# EAGLE design Webasto v4 (EAGLE 9.5.2)
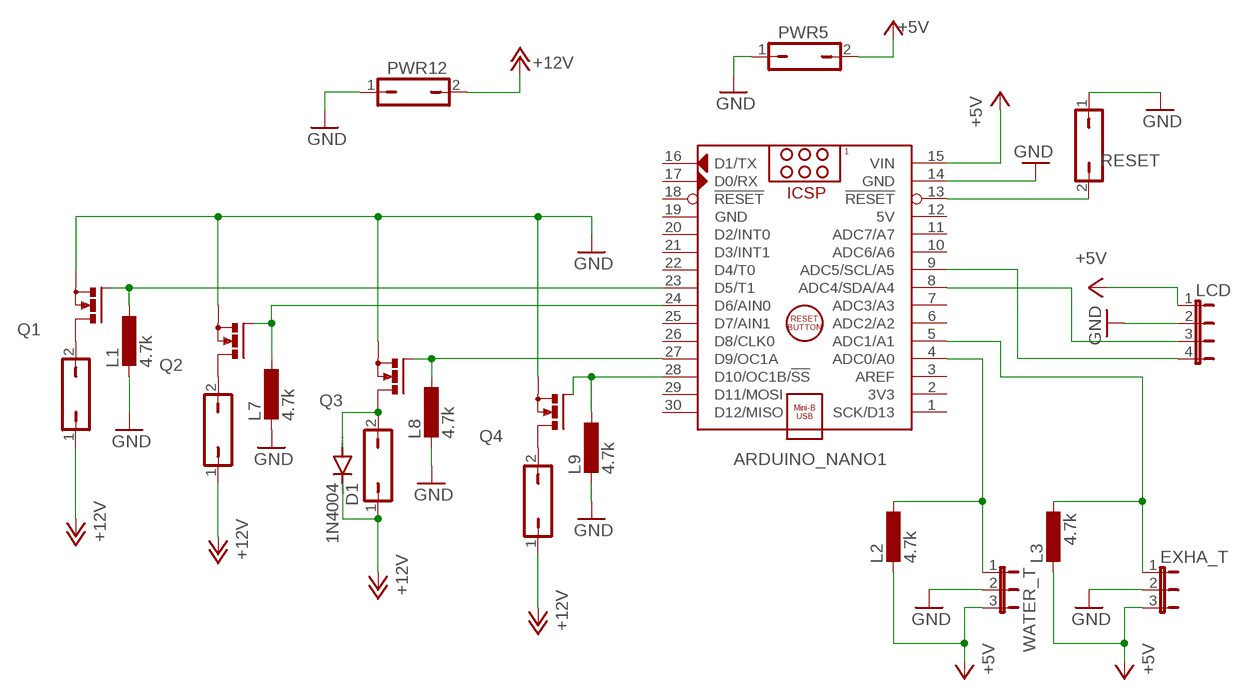
[diagram p0: schematic, sheet 1]

## Parts
ARDUINO_NANO1  ARDUINO_NANO  [ARDUINO_NANO]
D1  1N4004  [DO41-10]
EXHA_T  JP2E  [JP2]
FAN  794681-2  JP1Q  [JP1]
FUEL  794681-2  JP1Q  [JP1]
GLOW  794681-2  JP1Q  [JP1]
L1  4.7k  L-EU0204/7  [0204/7]
L2  4.7k  L-EU0204/7  [0204/7]
L3  4.7k  L-EU0204/7  [0204/7]
L7  4.7k  L-EU0204/7  [0204/7]
L8  4.7k  L-EU0204/7  [0204/7]
L9  4.7k  L-EU0204/7  [0204/7]
LCD  JP4E  [JP4]
PWR5  JP1Q  [JP1]
PWR12  JP1Q  [JP1]
Q1  IRLB8721  PMOSFET_NTO220BV  [TO220BV]
Q2  IRLB8721  PMOSFET_NTO220BV  [TO220BV]
Q3  IRLB8721  PMOSFET_NTO220BV  [TO220BV]
Q4  IRLB8721  PMOSFET_NTO220BV  [TO220BV]
RESET  power  JP1Q  [JP1]
WATER  794681-2  JP1Q  [JP1]
WATER_T  JP2E  [JP2]

## Nets
+5V: ARDUINO_NANO1.15(VIN) EXHA_T.3 L2.2 L3.2 LCD.1 PWR5.2 WATER_T.3
+12V: D1.C FAN.1 FUEL.1 GLOW.1 PWR12.2 WATER.1
GND: ARDUINO_NANO1.14(GND) EXHA_T.2 L1.2 L7.2 L8.2 L9.2 LCD.2 PWR5.1 PWR12.1 Q1.S Q2.S Q3.S Q4.S RESET.1 WATER_T.2
N$1: ARDUINO_NANO1.23(D5/T1) L1.1 Q1.G
N$2: FUEL.2 Q1.D
N$4: ARDUINO_NANO1.24(D6/AIN0) L7.1 Q2.G
N$5: GLOW.2 Q2.D
N$6: ARDUINO_NANO1.27(D9/OC1A) L8.1 Q3.G
N$7: D1.A FAN.2 Q3.D
N$8: ARDUINO_NANO1.28(D10/OC1B/!SS) L9.1 Q4.G
N$9: Q4.D WATER.2
N$10: ARDUINO_NANO1.8(ADC4/SDA/A4) LCD.3
N$11: ARDUINO_NANO1.9(ADC5/SCL/A5) LCD.4
N$12: ARDUINO_NANO1.5(ADC1/A1) EXHA_T.1 L3.1
N$13: ARDUINO_NANO1.4(ADC0/A0) L2.1 WATER_T.1
RESET: ARDUINO_NANO1.13(!RESET) RESET.2
Unconnected: ARDUINO_NANO1.1(SCK/D13) ARDUINO_NANO1.2(3V3) ARDUINO_NANO1.3(AREF) ARDUINO_NANO1.6(ADC2/A2) ARDUINO_NANO1.7(ADC3/A3) ARDUINO_NANO1.10(ADC6/A6) ARDUINO_NANO1.11(ADC7/A7) ARDUINO_NANO1.16(D1/TX) ARDUINO_NANO1.17(D0/RX) ARDUINO_NANO1.18(!RESET) ARDUINO_NANO1.20(D2/INT0) ARDUINO_NANO1.21(D3/INT1) ARDUINO_NANO1.22(D4/T0) ARDUINO_NANO1.25(D7/AIN1) ARDUINO_NANO1.26(D8/CLK0) ARDUINO_NANO1.29(D11/MOSI) ARDUINO_NANO1.30(D12/MISO)

## Power pins joined to a net without a drawn wire
5V: ARDUINO_NANO1.12(5V)
GND: ARDUINO_NANO1.19(GND)

## Library data of the parts
ARDUINO_NANO1 = ArduinoNanoV30:ARDUINO_NANO: Arduino Nano V3.0 Module Overview: The Arduino Nano is a small, complete, and breadboard-friendly board based on the ATmega328 (Arduino Nano 3.x) or ATmega168 (Arduino Nano 2.x). It has more or less the same functionality of the Arduino Duemilanove, but in a different package. It lacks only a DC power jack, and works with a Mini-B USB cable instead of a standard one. The Nano was designed and is being produced by Gravitech <http://www.gravitech.us/arna30wiatp.html>. General specifications: Item Value Microcontroller Atmel ATmega168 or ATmega328 Operating Voltage (logic level) 5 V Input Voltage (recommended) 7-12 V Input Voltage (limits) 6-20 V Digital I/O Pins 14 (of which 6 provide PWM output) Analog Input Pins 8 DC Current per I/O Pin 40 mA Flash Memory 16 KB (ATmega168) or 32 KB (ATmega328) of which 2 KB used by bootloader SRAM 1 KB (ATmega168) or 2 KB (ATmega328) EEPROM 512 bytes (ATmega168) or 1 KB (ATmega328) Clock Speed 16 MHz Dimensions (Inches) 0.73" x 1.70" Dimensions (mm) 18mm x 45mm Overall height About 9 mm (not including pins) Weigth 5 g Power: The Arduino Nano can be powered via the Mini-B USB connection, 6-20V unregulated external power supply (pin 30), or 5V regulated external power supply (pin 27). The power source is automatically selected to the highest voltage source. Memory: The ATmega168 has 16 KB of flash memory for storing code (of which 2 KB is used for the bootloader); the ATmega328 has 32 KB, (also with 2 KB used for the bootloader). The ATmega168 has 1 KB of SRAM and 512 bytes of EEPROM (which can be read and written with the EEPROM library); the ATmega328 has 2 KB of SRAM and 1 KB of EEPROM. Input and Output: Each of the 14 digital pins on the Nano can be used as an input or output, using pinMode(), digitalWrite(), and digitalRead() functions. They operate at 5 volts. Each pin can provide or receive a maximum of 40 mA and has an internal pull-up resistor (disconnected by default) of 20-50 kOhms. In addition, some pins have specialized functions. Visit Arduino - ArduinoBoardNano <https://www.arduino.cc/en/Main/ArduinoBoardNano>
D1 = diode:1N4004: DIODE general purpose rectifier, 1 A
EXHA_T WATER_T = jumper:JP2E: JUMPER
FAN FUEL GLOW PWR5 PWR12 RESET WATER = jumper:JP1Q: JUMPER
L1-L3 L7-L9 = rcl:L-EU: INDUCTOR, European symbol; SPICEPREFIX: L
LCD = jumper:JP4E: JUMPER
Q1-Q4 = transistor-power:PMOSFET_N: Power MOSFET N-Channel

## Net classes
0 default: clearance 0.205 mm

## Board
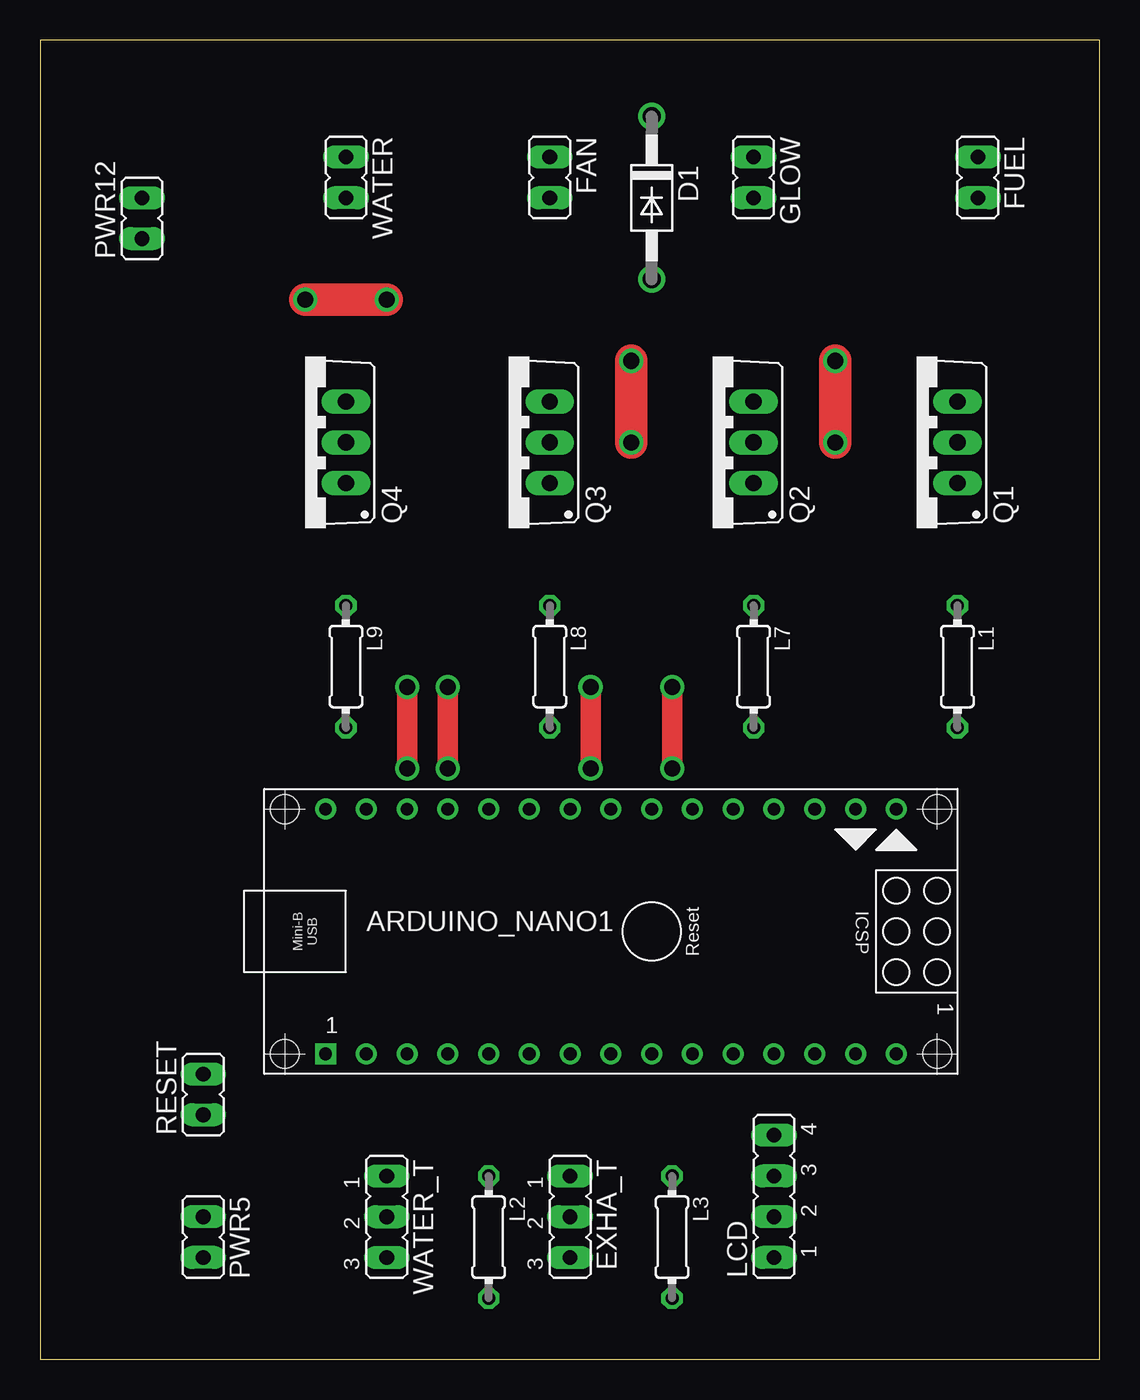
[diagram p1: board, top side]
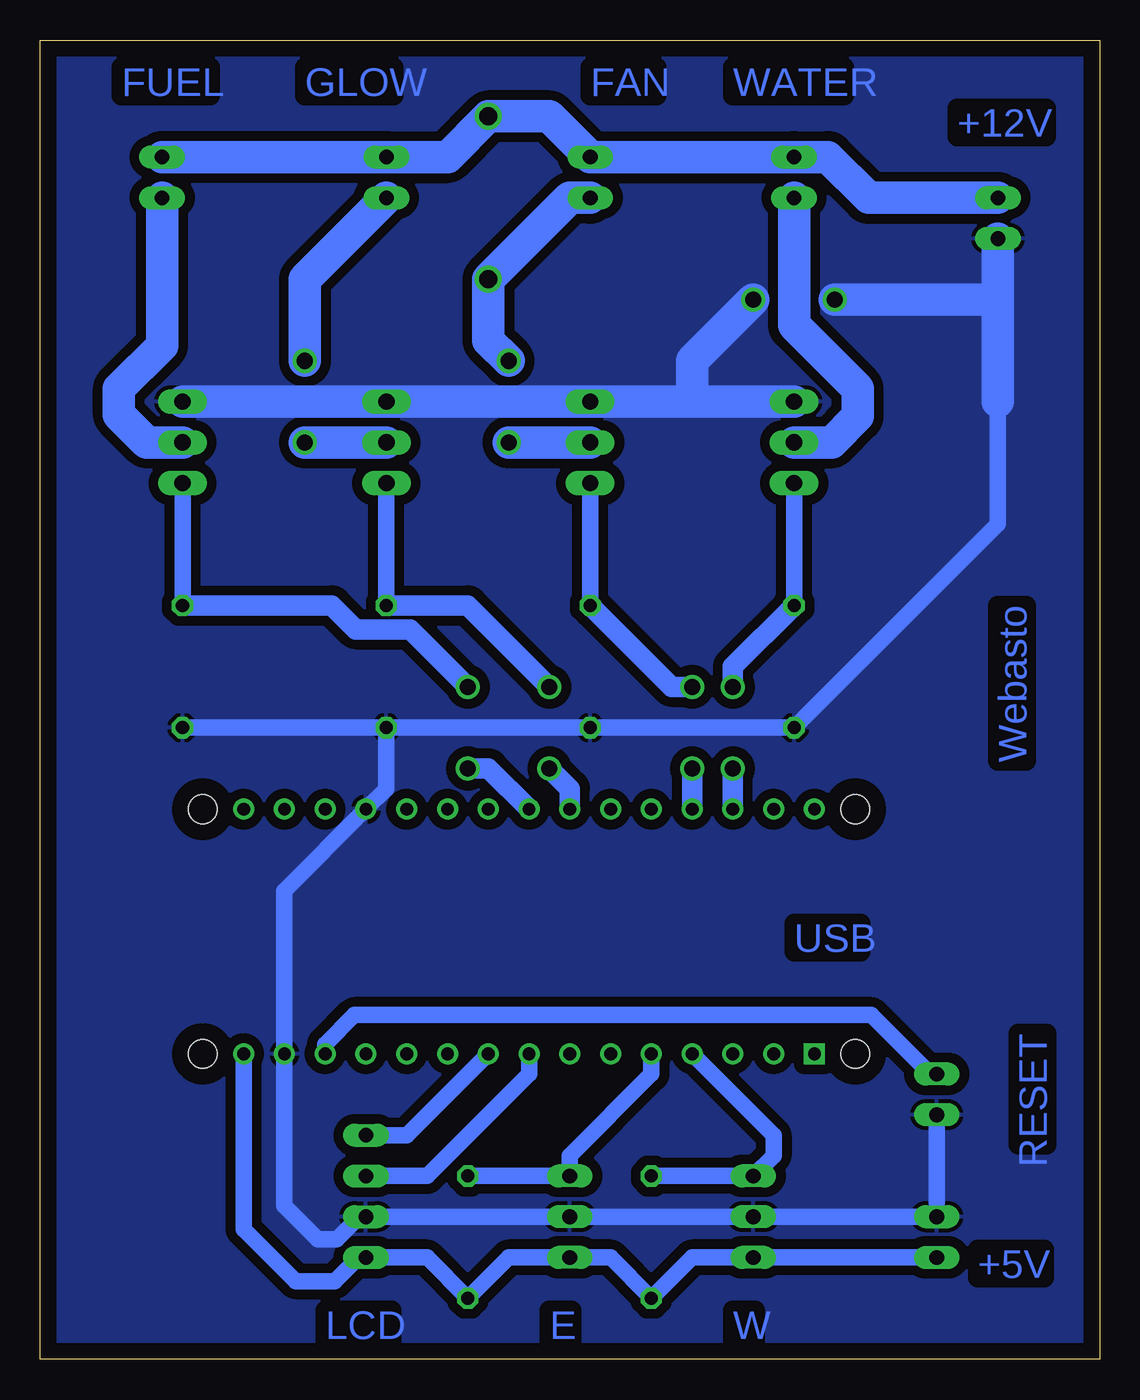
[diagram p2: board, bottom side, seen from below]

Size 66.02 x 82.22 mm. Coordinates in mm from the lower left corner, seen from the top.
Outline: 0,0 66.02,0 66.02,82.22 0,82.22 0,0
Copper layers (1*16): Top 0.035mm / dielectric 1.5mm / Bottom 0.035mm
Design rules "default": minimum track width 6mil, minimum drill 0.35mm, track to track 6mil, track to pad 6mil, pad to pad 6mil, via to via 6mil, smd to smd 6mil, copper to edge 40mil, drill to drill 6mil, minimum pad ring 10mil, minimum via ring 8mil, stop-mask expansion 4mil, vias tented up to drill 0mil, thermal gap 10mil

### Footprints (pad centres in the part's own frame; a part is rotated, then mirrored left to right if it is on the bottom)
ARDUINO_NANO = drill 0.8 square: 1 -20.32,-7.62 | drill 0.8: 2 -17.78,-7.62; 3 -15.24,-7.62; 4 -12.7,-7.62; 5 -10.16,-7.62; 6 -7.62,-7.62; 7 -5.08,-7.62; 8 -2.54,-7.62; 9 0,-7.62; 10 2.54,-7.62; 11 5.08,-7.62; 12 7.62,-7.62; 13 10.16,-7.62; 14 12.7,-7.62; 15 15.24,-7.62; 16 15.24,7.62; 17 12.7,7.62; 18 10.16,7.62; 19 7.62,7.62; 20 5.08,7.62; 21 2.54,7.62; 22 0,7.62; 23 -2.54,7.62; 24 -5.08,7.62; 25 -7.62,7.62; 26 -10.16,7.62; 27 -12.7,7.62; 28 -15.24,7.62; 29 -17.78,7.62; 30 -20.32,7.62 | hole 1.778: -22.86,-7.62; -22.86,7.62; 17.78,7.62; 17.78,-7.62
DO41-10 = drill 1.118: A 5.08,0; C -5.08,0
JP2 = drill 0.914 long: 1 -2.54,0; 2 0,0; 3 2.54,0
JP1 = drill 0.914 long: 1 0,-1.27; 2 0,1.27
0204/7 = drill 0.813 octagon: 1 -3.81,0; 2 3.81,0
JP4 = drill 0.914 long: 1 -3.81,0; 2 -1.27,0; 3 1.27,0; 4 3.81,0
TO220BV = drill 1.016 long: D 0,-2.54; G -2.54,-2.54; S 2.54,-2.54

### Placement (x,y rotation side)
ARDUINO_NANO1  38.1,26.67 0 top
D1  38.1,72.39 270 top
EXHA_T  33.02,8.89 270 top
FAN  31.75,73.66 180 top
FUEL  58.42,73.66 180 top
GLOW  44.45,73.66 180 top
L1  57.15,43.18 270 top
L2  27.94,7.62 270 top
L3  39.37,7.62 270 top
L7  44.45,43.18 270 top
L8  31.75,43.18 270 top
L9  19.05,43.18 270 top
LCD  45.72,10.16 90 top
PWR5  10.16,7.62 180 top
PWR12  6.35,71.12 0 top
Q1  54.61,57.15 90 top
Q2  41.91,57.15 90 top
Q3  29.21,57.15 90 top
Q4  16.51,57.15 90 top
RESET  10.16,16.51 0 top
WATER  19.05,73.66 180 top
WATER_T  21.59,8.89 270 top

### Tracks (layer width: path | path; a pad name or v marks a point on that pad's centre or on a via)
+5V
  Bottom 1.016: PWR5.2 WATER_T.3 25.4,6.35 L2.2 30.48,6.35 EXHA_T.3 36.83,6.35 L3.2 41.91,6.35 LCD.1 46.18,6.35 47.65,4.88 50.1,4.88 53.34,8.12 ARDUINO_NANO1.15
+12V
  Bottom 2.032: PWR12.2 14.41,72.39 16.95,74.93 WATER.1 FAN.1 34.29,77.47 D1.C 40.64,74.93 GLOW.1 FUEL.1
GND  (via drill 1)
  Top 2.032: v16.51,66.04 v21.59,66.04
  Bottom 1.016: RESET.1 PWR5.1 WATER_T.2 EXHA_T.2 LCD.2 46.15,8.89 47.55,7.49 48.73,7.49 50.8,9.57 ARDUINO_NANO1.14 50.8,29.21 ARDUINO_NANO1.19 44.45,35.56 L7.2 | L7.2 L1.2 | L7.2 L8.2 L9.2 6.35,52.07 6.35,59.69
  Bottom 2.032: PWR12.1 6.35,66.04 | 6.35,66.04 6.35,59.69 | v16.51,66.04 6.35,66.04 | Q3.S 25.4,59.69 25.4,62.23 v21.59,66.04 | Q4.S Q3.S | Q3.S Q2.S | Q2.S 45.72,59.69 | Q1.S Q2.S
  pour Bottom (isolate 0.61): 0,82.55 66.04,82.55 66.04,0 0,0
N$1  (via drill 1 pad 1)
  Top 1.27: v39.37,41.91 v39.37,36.83
  Bottom 1.016: L1.1 Q1.G
  Bottom 1.27: ARDUINO_NANO1.23 38.1,36.83 v39.37,36.83 | L1.1 47.84,46.99 46.34,45.49 42.95,45.49 v39.37,41.91
N$2
  Bottom 2.032: Q1.D 59.37,57.15 61.11,58.89 61.11,60.49 58.42,63.18 FUEL.2
N$4  (via drill 1 pad 1)
  Top 1.27: v34.29,41.91 v34.29,36.83
  Bottom 1.016: L7.1 Q2.G
  Bottom 1.27: ARDUINO_NANO1.24 33.02,35.56 v34.29,36.83 | L7.1 39.37,46.99 v34.29,41.91
N$5  (via drill 1)
  Top 2.032: v49.53,57.15 v49.53,62.23
  Bottom 2.032: Q2.D v49.53,57.15 | GLOW.2 49.53,67.31 v49.53,62.23
N$6  (via drill 1 pad 1)
  Top 1.27: v25.4,41.91 v25.4,36.83
  Bottom 1.016: L8.1 Q3.G
  Bottom 1.27: L8.1 26.67,41.91 v25.4,41.91 | ARDUINO_NANO1.27 v25.4,36.83
N$7  (via drill 1)
  Top 2.032: v36.83,62.23 v36.83,57.15
  Bottom 2.032: FAN.2 33.02,72.39 D1.A 38.1,63.5 v36.83,62.23 | Q3.D v36.83,57.15
N$8  (via drill 1 pad 1)
  Top 1.27: v22.86,41.91 v22.86,36.83
  Bottom 1.016: L9.1 Q4.G
  Bottom 1.27: L9.1 22.86,43.18 v22.86,41.91 | ARDUINO_NANO1.28 v22.86,36.83
N$9
  Bottom 2.032: Q4.D 16.71,57.15 15.09,58.78 15.09,60.49 19.05,64.45 WATER.2
N$10
  Bottom 1.016: LCD.3 41.91,11.43 35.56,17.78 ARDUINO_NANO1.8
N$11
  Bottom 1.016: LCD.4 43.18,13.97 ARDUINO_NANO1.9
N$12
  Bottom 1.016: ARDUINO_NANO1.5 27.94,17.78 33.02,12.7 EXHA_T.1 L3.1
N$13
  Bottom 1.016: L2.1 WATER_T.1 20.32,12.7 20.32,13.97 ARDUINO_NANO1.4
RESET
  Bottom 1.016: ARDUINO_NANO1.13 48.26,19.64 46.44,21.46 14.24,21.46 10.56,17.78 RESET.2

### Text on the board
Bottom: WATER | FAN | GLOW | FUEL | +12V | Webasto | USB | RESET | +5V | W | E | LCD